# EAGLE design Optogenetic-stimulator-v1 (EAGLE 9.6.2)
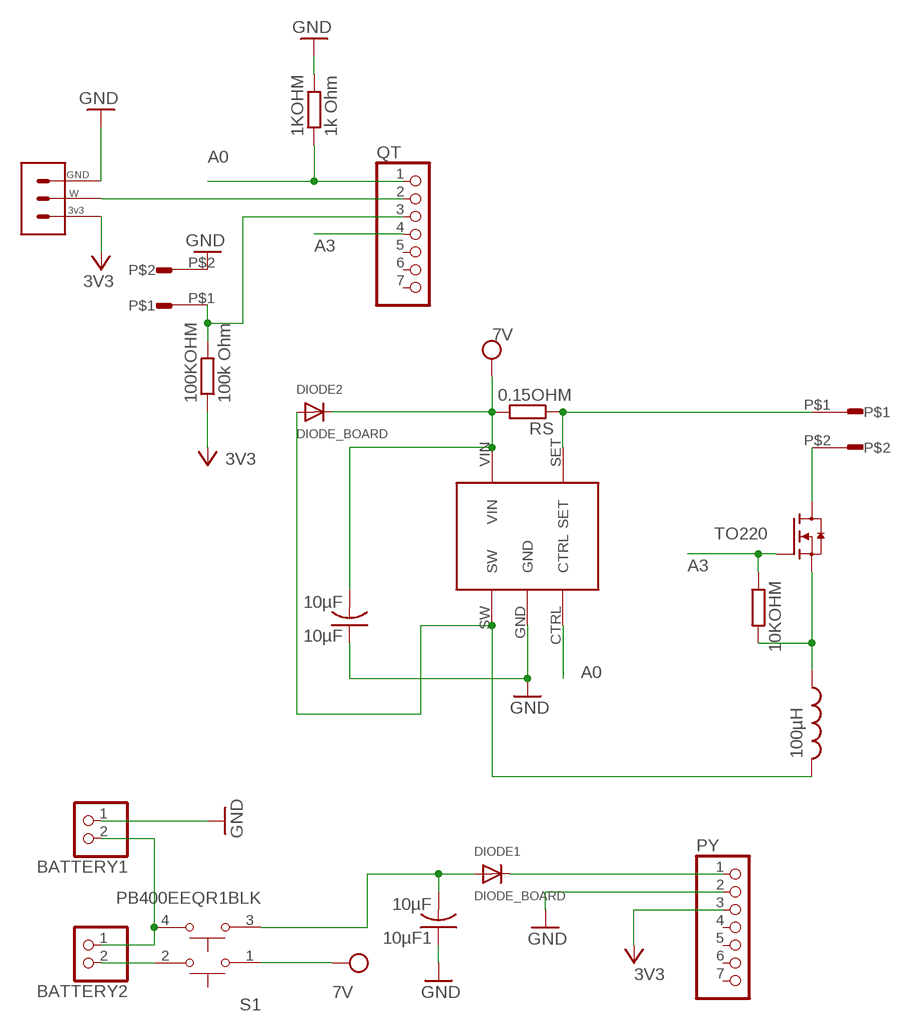
[diagram p0: schematic, sheet 1]

## Parts
1KOHM  1k Ohm  R-EU_M1206  [M1206]
10KOHM  R-EU_M1206  [M1206]
10µF  10µF  C-USC1206  [C1206]
10µF1  10µF  C-USC1206  [C1206]
100KOHM  100k Ohm  R-EU_M1206  [M1206]
AL8860WT1  AL8860WT  [AL8860WT]
BATTERY1  JST_2PIN-THM  [JST-PH-2-THM]
BATTERY2  JST_2PIN-THM  [JST-PH-2-THM]
DIODE1  DIODE_BOARD  [DIODE]
DIODE2  DIODE_BOARD  [DIODE]
LED  UNIVERSAL_PAD  [UNIVERSAL_PAD]
NTC  UNIVERSAL_PAD  [UNIVERSAL_PAD]
PY  PINHD-1X7  [1X07]
QT  PINHD-1X7  [1X07]
RS  0.15OHM  R-EU_M1206  [M1206]
S1  PB400EEQR1BLK  [SW_PB400EEQR1BLK]
TO220  MOSFET-TO220  [TO220]
U$1  BOARD_INDUCTOR  [INDUCTOR]
U$6  POTENTIOMETER_BOARD  [POTENTIOMETER_BOARD]

## Nets
3V3: 100KOHM.1 PY.3 U$6.3V3 ; supply symbol labelled 3v3
7V: 10µF.2 AL8860WT1.VIN DIODE2.P$2(C) RS.2 S1.1 ; supply symbol labelled 7 V
A0: 1KOHM.1 AL8860WT1.CTRL QT.1
A3: 10KOHM.1 QT.4 TO220.1(G)
GND: 1KOHM.2 10µF1.1 10µF.1 AL8860WT1.GND BATTERY1.1 NTC.P$2 PY.2 U$6.GND
N$1: BATTERY1.2 BATTERY2.1 S1.4
N$2: DIODE1.P$2(C) PY.1
N$3: LED.P$2 TO220.2(D)
N$4: 10µF1.2 DIODE1.P$1(A) S1.3
N$5: 100KOHM.2 NTC.P$1 QT.3
N$6: BATTERY2.2 S1.2
N$8: AL8860WT1.SW DIODE2.P$1(A) U$1.P$2
N$9: QT.2 U$6.W
N$10: AL8860WT1.SET LED.P$1 RS.1
N$11: 10KOHM.2 TO220.3(S) U$1.P$1
Unconnected: PY.4 PY.5 PY.6 PY.7 QT.5 QT.6 QT.7

## Library data of the parts
1KOHM 10KOHM 100KOHM RS = rcl:R-EU_: RESISTOR, European symbol; SPICEPREFIX: R
10µF 10µF1 = rcl:C-US: CAPACITOR, American symbol; SPICEPREFIX: C
AL8860WT1 = AL8860WT:AL8860WT
BATTERY1 BATTERY2 = adafruit:JST_2PIN: JST 2-Pin Connectors of various flavors SMT-RA (S2B-PH-SM4) 4UConnector #17311 SMT (B2B-PH-SM4) THM-RA (S2B-PH) THM (B2B-PH)
DIODE1 DIODE2 = DIODE_BOARD:DIODE_BOARD
LED NTC = UNIVERSAL_PAD:UNIVERSAL_PAD
PY QT = pinhead:PINHD-1X7: PIN HEADER
S1 = Custom_Board:PB400EEQR1BLK: Check availability <https://pricing.snapeda.com/parts/PB400EEQR1BLK/E-Switch/view-part?ref=eda>; AVAILABILITY: In Stock; CHECK_PRICES: https://www.snapeda.com/parts/PB400EEQR1BLK/E-Switch/view-part/?ref=eda; DESCRIPTION: Pushbutton Switch, DPST,OFF-ON, Round Actuator,3A,30VDC, R/A PC, PB400 Series | E-Switch PB400EEQR1BLK; MF: E-Switch; MP: PB400EEQR1BLK; PACKAGE: None; PRICE: None; PURCHASE-URL: https://www.snapeda.com/api/url_track_click_mouser/?unipart_id=2760202&manufacturer=E-Switch&part_name=PB400EEQR1BLK&search_term=None; SNAPEDA_LINK: https://www.snapeda.com/parts/PB400EEQR1BLK/E-Switch/view-part/?ref=snap
TO220 = Custom_Board:MOSFET-TO220
U$1 = INDUCTOR_BOARD:BOARD_INDUCTOR
U$6 = POTENTIOMETER_BOARD:POTENTIOMETER_BOARD

## Board
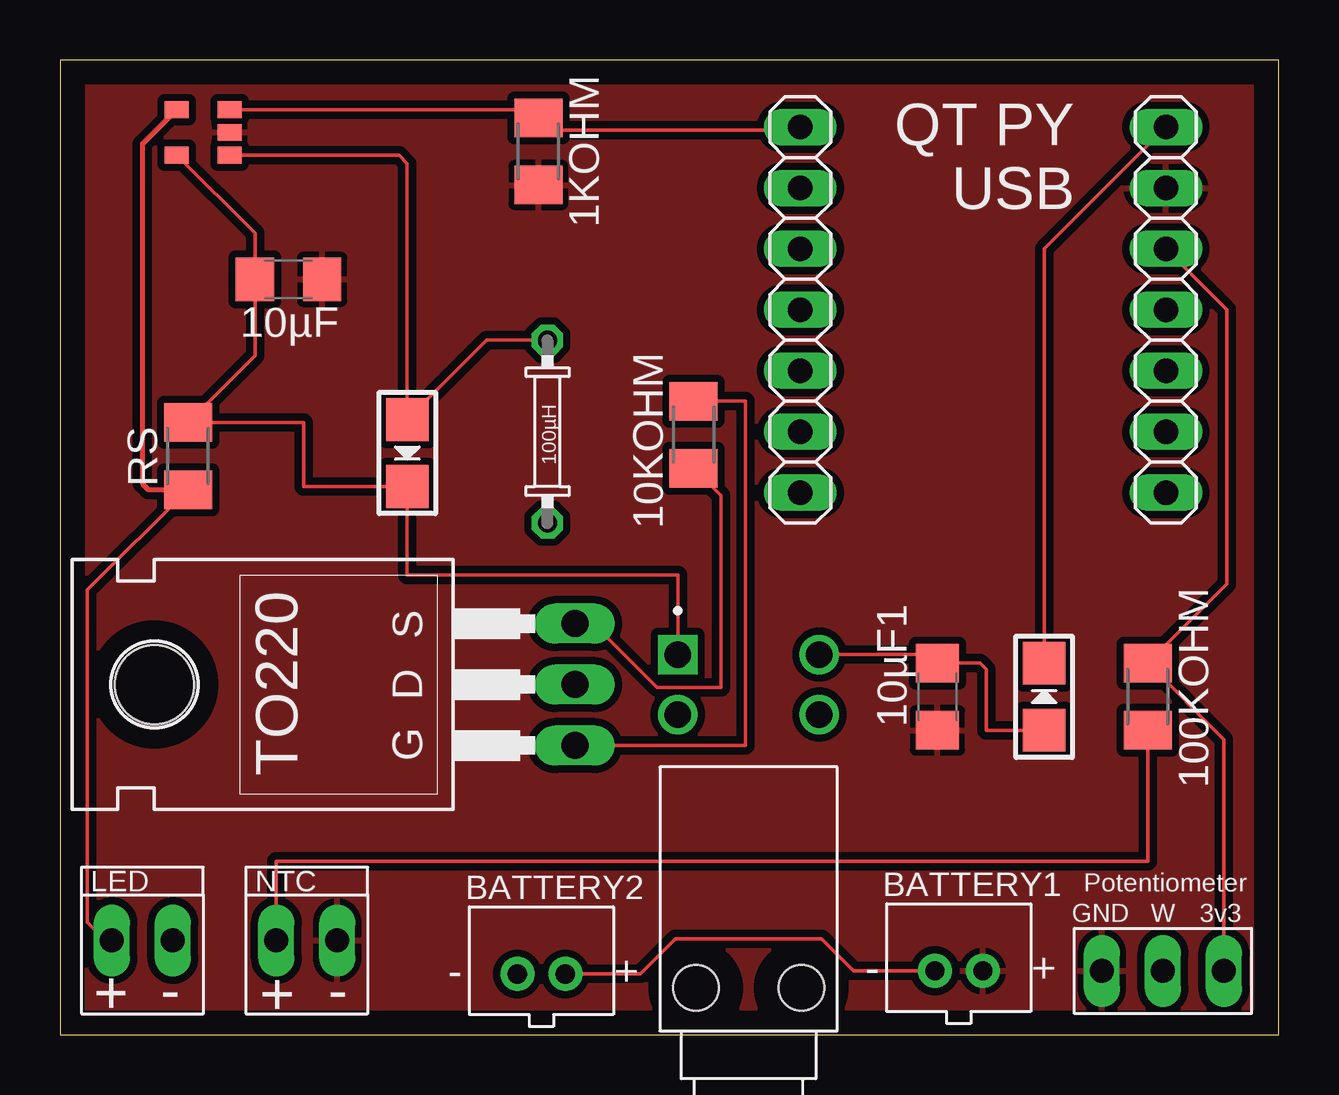
[diagram p1: board, top side]
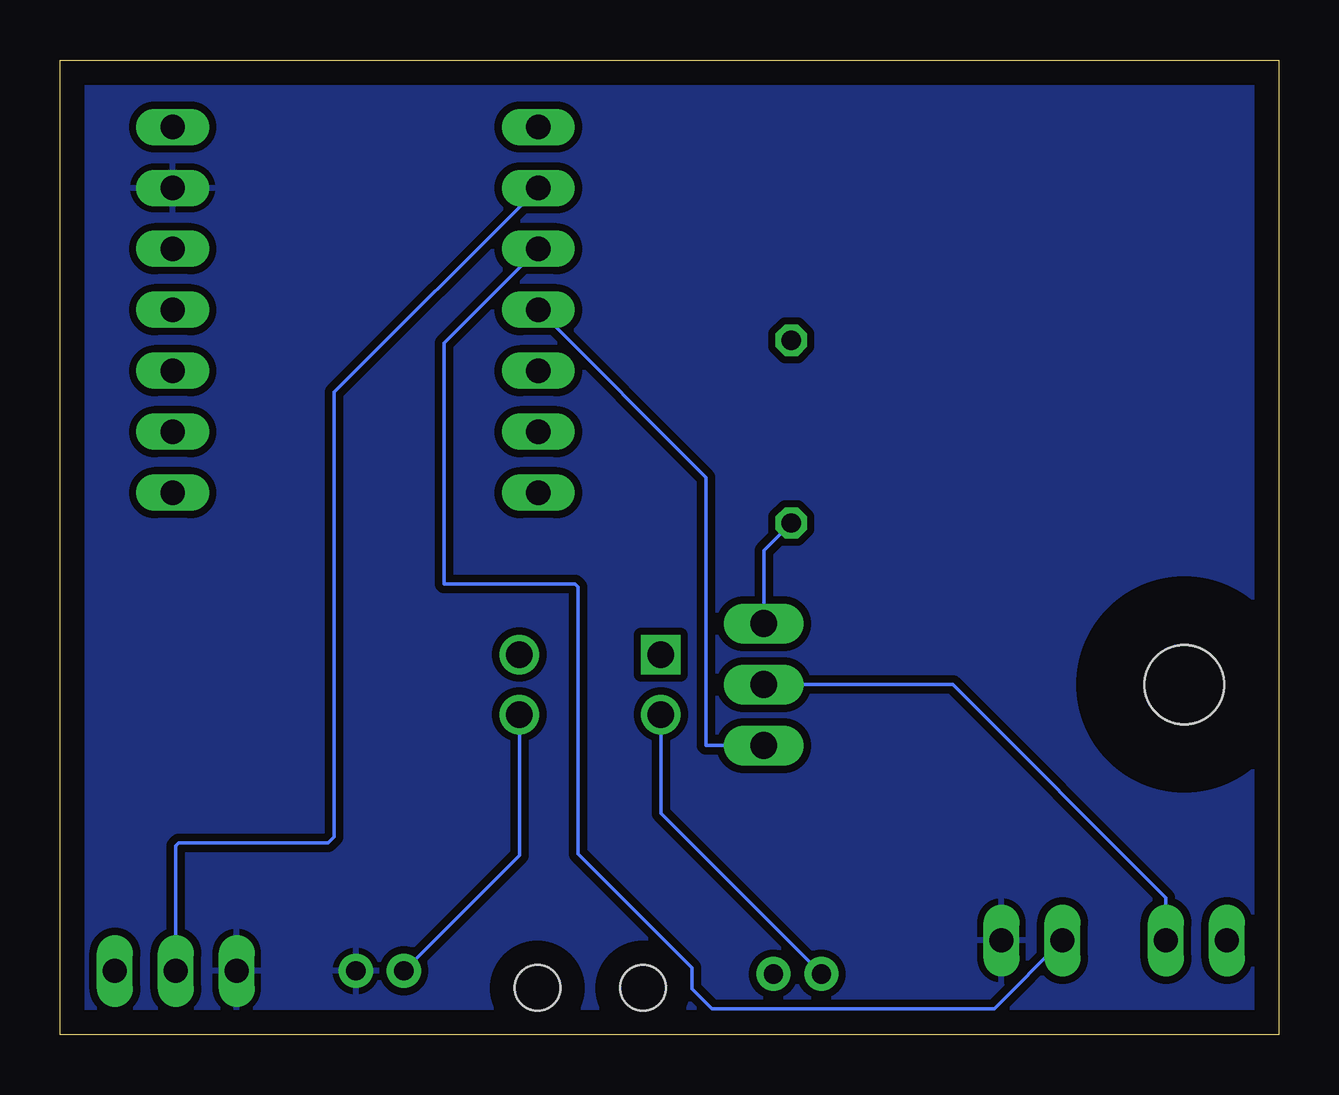
[diagram p2: board, bottom side, seen from below]

Size 50.8 x 40.64 mm. Coordinates in mm from the lower left corner, seen from the top.
Outline: 0,0 50.8,0 50.8,40.64 0,40.64 0,0
Copper layers (1*16): Top 0.035mm / dielectric 1.5mm / Bottom 0.035mm
Design rules "default": minimum track width 6mil, minimum drill 0.35mm, track to track 6mil, track to pad 6mil, pad to pad 6mil, via to via 6mil, smd to smd 6mil, copper to edge 40mil, drill to drill 6mil, minimum pad ring 10mil, minimum via ring 8mil, stop-mask expansion 4mil, vias tented up to drill 0mil, thermal gap 10mil

### Footprints (pad centres in the part's own frame; a part is rotated, then mirrored left to right if it is on the bottom)
M1206 = smd 1.6 x 2: 1 -1.4,0; 2 1.4,0
C1206 = smd 1.6 x 1.8: 1 -1.4,0; 2 1.4,0
AL8860WT = smd 1 x 0.7: CTRL -1.1,-2.25; GND -1.1,-1.3; SET 1.1,-2.25; SW -1.1,-0.35; VIN 1.1,-0.35
JST-PH-2-THM = drill 0.8 pad 1.422: 1 1,0; 2 -1,0
DIODE = smd 1.778 x 1.778: P$1 -1.397,0; P$2 1.397,0
UNIVERSAL_PAD = drill 1 long: P$1 -1.27,0; P$2 1.27,0
1X07 = drill 1.016 long: 1 -7.62,0; 2 -5.08,0; 3 -2.54,0; 4 0,0; 5 2.54,0; 6 5.08,0; 7 7.62,0
SW_PB400EEQR1BLK = drill 1.1 square: 1 -1.25,-2.95 | drill 1.1: 2 1.25,-2.95; 3 -1.25,2.95; 4 1.25,2.95 | hole 1.9: 12.65,2.2; 12.65,-2.2
TO220 = drill 1.118 long: 1 -2.54,-6.35; 2 0,-6.35; 3 2.54,-6.35 | hole 3.302: 0,11.176
INDUCTOR = drill 0.8 pad 1.27 octagon: P$1 0,0; P$2 0,-7.62
POTENTIOMETER_BOARD = drill 1 long: 3V3 2.54,0; GND -2.54,0; W 0,0

### Placement (x,y rotation side)
1KOHM  19.94,36.83 270 top
10KOHM  26.42,25.02 270 top
10µF  9.53,31.5 180 top
10µF1  36.58,14.1 90 top
100KOHM  45.34,14.1 270 top
AL8860WT1  5.97,36.32 180 top
BATTERY1  37.47,2.67 0 top
BATTERY2  20.07,2.54 0 top
DIODE1  41.02,14.1 90 top
DIODE2  14.48,24.26 270 top
LED  3.43,3.94 0 top
NTC  10.29,3.94 0 top
PY  46.1,30.23 270 top
QT  30.86,30.23 270 top
RS  5.33,24.13 90 top
S1  28.7,14.61 270 top
TO220  15.11,14.61 90 top
U$1  20.32,21.34 180 top
U$6  45.97,2.67 0 top

### Tracks (layer width: path | path; a pad name or v marks a point on that pad's centre or on a via)
3V3
  Top 0.152: PY.3 48.64,30.23 48.64,18.8 100KOHM.1 48.51,12.32 U$6.3V3
7V
  Top 0.152: AL8860WT1.VIN 8.12,33.42 10µF.2 8.12,28.32 RS.2 10.16,25.53 10.16,22.86 DIODE2.P$2 14.48,19.18 25.75,19.18 S1.1
A0
  Top 0.152: QT.1 30.73,37.72 20.45,37.72 1KOHM.1 19.6,38.57 AL8860WT1.CTRL
A3
  Top 0.152: TO220.1 28.57,12.06 28.57,26.42 10KOHM.1
  Bottom 0.152: QT.4 23.88,23.24 23.88,12.06 TO220.1
GND
  pour Bottom (isolate 0.305): 0,40.64 50.8,40.64 50.8,0 0,0
  pour Top (isolate 0.305): 0,40.64 50.8,40.64 50.8,0 0,0
N$1
  Top 0.152: BATTERY2.1 24.2,2.54 25.66,4 31.75,4 33.08,2.67 BATTERY1.2
  Bottom 0.152: S1.4 31.65,7.48 BATTERY1.2
N$2
  Top 0.152: DIODE1.P$2 41.02,32.77 PY.1
N$3
  Bottom 0.152: LED.P$2 4.7,5.71 13.59,14.61 TO220.2
N$4
  Top 0.152: S1.3 36.22,15.86 10µF1.2 38.35,15.5 38.61,15.24 38.61,12.7 DIODE1.P$1
N$5
  Top 0.152: 100KOHM.2 45.34,7.24 9.02,7.24 NTC.P$1
  Bottom 0.152: NTC.P$1 11.86,1.09 23.62,1.09 24.46,1.93 24.46,2.8 29.21,7.55 29.21,18.67 29.34,18.8 34.8,18.8 34.8,28.83 QT.3
N$6
  Bottom 0.152: BATTERY2.2 25.75,9.23 S1.2
N$8
  Top 0.152: U$1.P$2 17.78,28.96 DIODE2.P$1 14.48,36.32 14.13,36.67 AL8860WT1.SW
N$9
  Bottom 0.152: QT.2 39.37,26.8 39.37,8.26 39.62,8 45.85,8 45.97,7.87 U$6.W
N$10
  Top 0.152: RS.1 1.14,18.54 1.14,4.7 1.91,3.94 LED.P$1
  Top 0.2: AL8860WT1.SET 3.43,37.13 3.43,22.99 3.69,22.73 RS.1
N$11
  Top 0.152: TO220.3 22.23,17.14 24.89,14.48 27.56,14.48 27.56,22.48 10KOHM.2
  Bottom 0.152: U$1.P$1 21.46,20.19 TO220.3

### Text on the board
tPlace: QT PY / USB | + | + | - | -